# EAGLE schematic squaresynth (EAGLE 6.3)
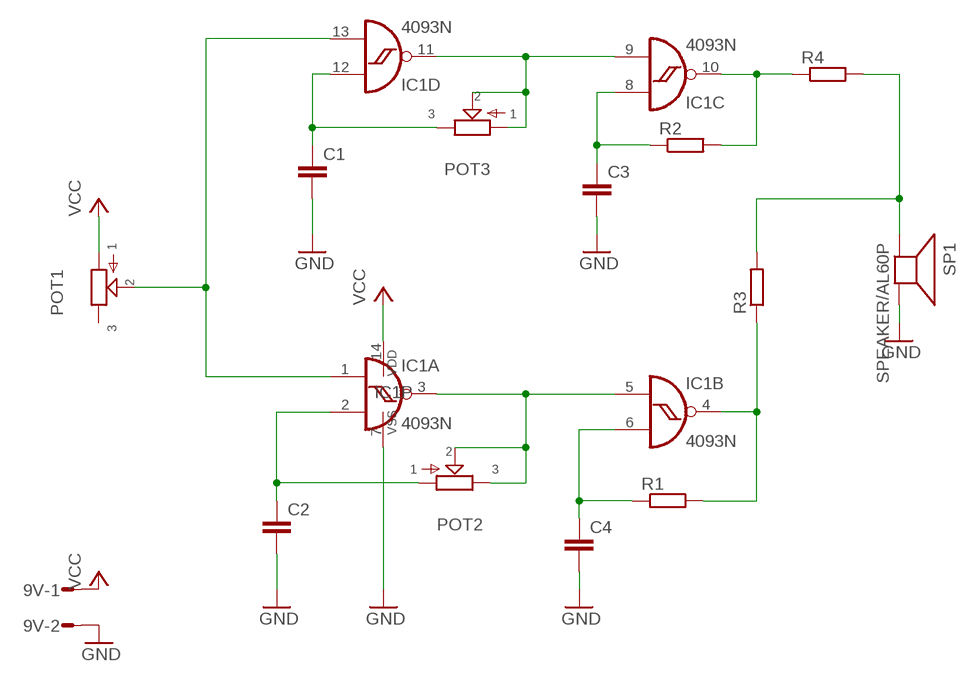
[diagram p0: schematic, sheet 1]

## Parts
9V  M02S  [02P]
C1  C-EU050-030X075  [C050-030X075]
C2  C-EU050-030X075  [C050-030X075]
C3  C-EU075-032X103  [C075-032X103]
C4  C-EU075-032X103  [C075-032X103]
IC1  4093N  [DIL14]
POT1  POT-EU16MM  [16MM]
POT2  POT-EU16MM  [16MM]
POT3  POT-EU16MM  [16MM]
R1  R-EU_0309/12  [0309/12]
R2  R-EU_0309/12  [0309/12]
R3  R-EU_0309/12  [0309/12]
R4  R-EU_0309/12  [0309/12]
SP1  SPEAKER/AL60P  [AL60P]

## Nets
GND: 9V.2 C1.2 C2.2 C3.2 C4.2 IC1.7(P:VSS) SP1.2(-)
N$1: IC1.1(A:I0) IC1.13(D:I1) POT1.2
N$2: IC1.3(A:O) IC1.5(B:I0) POT2.2 POT2.3
N$3: C1.1 IC1.12(D:I0) POT3.3
N$4: IC1.9(C:I1) IC1.11(D:O) POT3.1 POT3.2
N$5: C2.1 IC1.2(A:I1) POT2.1
N$6: IC1.10(C:O) R2.2 R4.1
N$7: C4.1 IC1.6(B:I1) R1.1
N$8: R3.2 R4.2 SP1.1(+)
N$9: IC1.4(B:O) R1.2 R3.1
N$10: C3.1 IC1.8(C:I0) R2.1
VCC: 9V.1 IC1.14(P:VDD) POT1.1
Unconnected: POT1.3

## Library data of the parts
9V = con-amp-quick:M02S: AMP QUICK CONNECTOR
C1-C4 = rcl:C-EU: CAPACITOR, European symbol
IC1 = 40xx:4093: Quad 2-input NAND schmitt trigger
POT1-POT3 = gm-pots:POT-EU
R1-R4 = rcl:R-EU_: RESISTOR, European symbol
SP1 = adafruit:SPEAKER: SPEAKER Source: Buerklin Added PS12 (for part # PS1240 piezo) http://www.ladyada.net/library/pcb/eaglelibrary.html